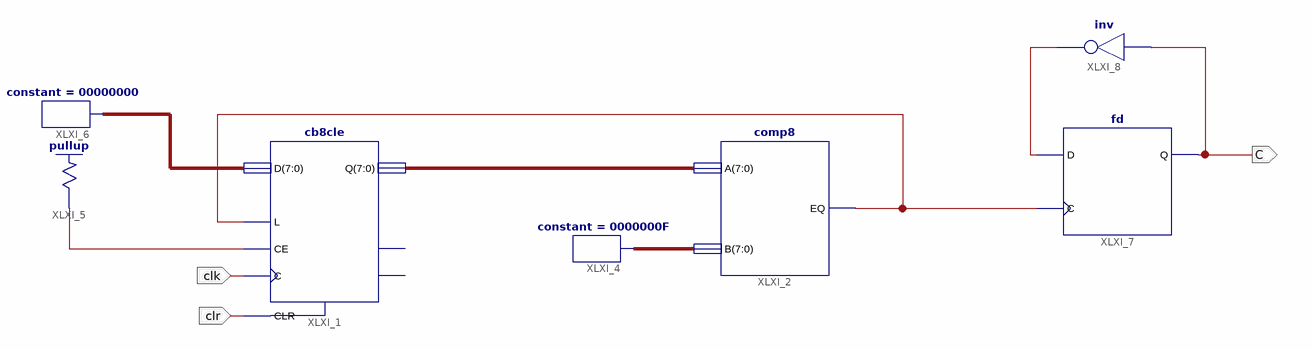
[diagram p0: schematic sheet 1]
// Xilinx ISE schematic Compare15.sch (spartan6) as structural Verilog: 7 symbols, 3 ports
module Compare15 (
  input  clk,
  input  clr,
  output C
);

  wire XLXN_4, XLXN_10, XLXN_11;
  wire [7:0] XLXN_1, XLXN_3, XLXN_8;

  cb8cle XLXI_1 (.C(clk), .CE(XLXN_4), .CLR(clr), .D(XLXN_8), .L(XLXN_10), .Q(XLXN_1));  // open: CEO, TC
  comp8 XLXI_2 (.A(XLXN_1), .B(XLXN_3), .EQ(XLXN_10));
  constant #(.CValue("0000000F")) XLXI_4 (.O(XLXN_3));
  \pullup  XLXI_5 (.O(XLXN_4));
  constant #(.CValue("00000000")) XLXI_6 (.O(XLXN_8));
  fd XLXI_7 (.C(XLXN_10), .D(XLXN_11), .Q(C));
  not XLXI_8 (XLXN_11, C);
endmodule
